# Altium schematic sheet CanSat1_Sch.SchDoc
size A4
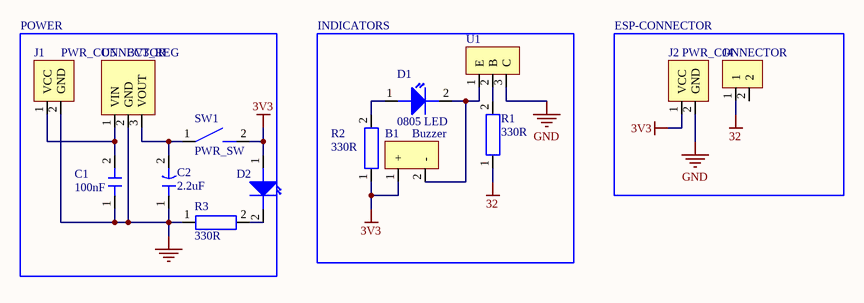
[diagram p0: CanSat1_Sch.SchDoc]

## Parts
B1  Buzzer  [BUZZER]
C1  100nF  [CERAMIC CAP]
C2  2.2uF  [Electrolytic capacitor 2mm]
D1  0805 LED  [3mm_LED]
D2  0805 LED  [3mm_LED]  (value not drawn)
J1  PWR_CONNECTOR  [BATT]
J2  PWR_CONNECTOR  [BATT]
J4  2x1_CONN  [CONN2x1_2.54mm]  (value not drawn)
R1  330R  [THT RESISTOR]
R2  330R  [THT RESISTOR]
R3  330R  [THT RESISTOR]
SW1  PWR_SW  [PWR-SW]
U1  NPN Transistor  [2N2222A]  (value not drawn)
U5  3V3_REG  [LF33CV]

## Blocks framed on the sheet
POWER: C1 C2 D2 J1 R3 SW1 U5
INDICATORS: B1 D1 R1 R2 U1
ESP-CONNECTOR: J2 J4

## Nets
3V3: B1.1(+) D2.1(A) J2.1(VCC) R2.1 SW1.2(+)
32: J4.1 R1.1
GND: C1.1(+) C2.1(+) J1.2(GND) J2.2(GND) R3.1 U1.3(C) U5.2(GND)
NetB1_2: B1.2(-) D1.2(K) U1.1(E)
NetC1_2: C1.2(-) J1.1(VCC) U5.1(VIN)
NetC2_2: C2.2(-) SW1.1(+) U5.3(VOUT)
NetD1_1: D1.1(A) R2.2
NetD2_2: D2.2(K) R3.2
NetR1_2: R1.2 U1.2(B)

Not connected (* = marked no-connect by the designer): J4 2

## Library data of the parts
B1 = BUZZER: Active buzzer
C1 = CAP: Ceramic through-hole capacitor
C2 = E_CAP_2.2uF: Throug-hole 2.2uF
D1 D2 = LED: Through-hole LED
J1 J2 = PWR-CONN: THT Connector
J4 = CONN 2x1: THT 2x1 2.54mm CONN
R1-R3 = Resistor: Through-hole resistor
SW1 = SWITCH: Mechanical through-hole switch
U1 = 2N2222: Through-hole NPN Transistor
U5 = LF33CV: Through-hole 3.3V regulator